# EAGLE design register (EAGLE 5.11)
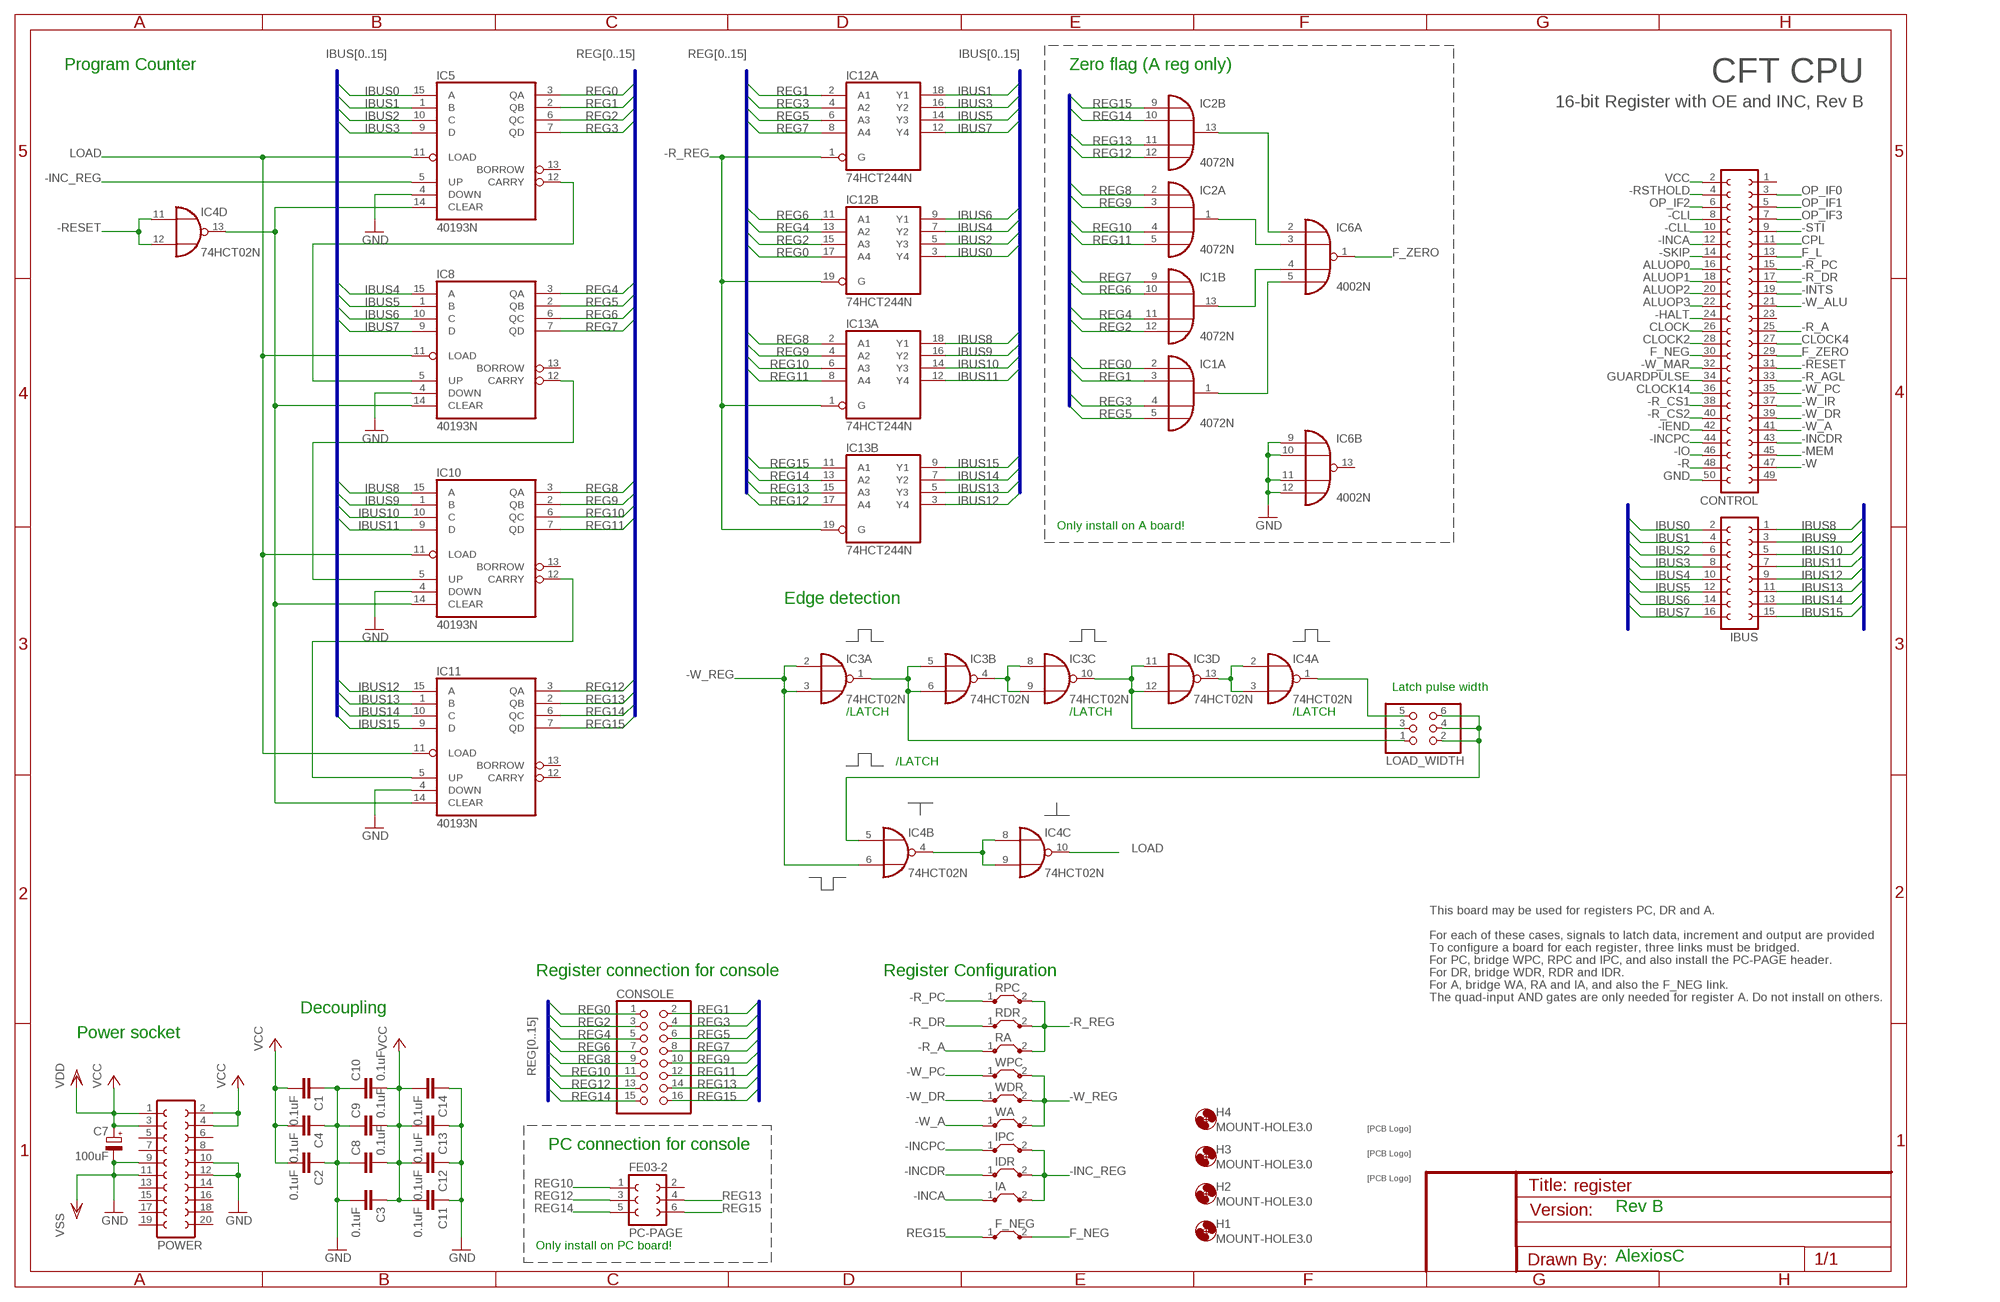
[diagram p0: schematic, sheet 1]

## Parts
C1  0.1uF  C-EU025-025X050  [C025-025X050]
C2  0.1uF  C-EU025-025X050  [C025-025X050]
C3  0.1uF  C-EU025-025X050  [C025-025X050]
C4  0.1uF  C-EU025-025X050  [C025-025X050]
C7  100uF  CPOL-EUE2.5-6  [E2,5-6]
C8  0.1uF  C-EU025-025X050  [C025-025X050]
C9  0.1uF  C-EU025-025X050  [C025-025X050]
C10  0.1uF  C-EU025-025X050  [C025-025X050]
C11  0.1uF  C-EU025-025X050  [C025-025X050]
C12  0.1uF  C-EU025-025X050  [C025-025X050]
C13  0.1uF  C-EU025-025X050  [C025-025X050]
C14  0.1uF  C-EU025-025X050  [C025-025X050]
CONSOLE  PINHD-2X8/90  [2X08/90]
CONTROL  FE25-2  [FE25-2]
F_NEG  J5MM  [05]
H1  MOUNT-HOLE3.0  [3,0]
H2  MOUNT-HOLE3.0  [3,0]
H3  MOUNT-HOLE3.0  [3,0]
H4  MOUNT-HOLE3.0  [3,0]
IA  J5MM  [05]
IBUS  FE08-2  [FE08-2]
IC1  4072N  [DIL14]
IC2  4072N  [DIL14]
IC3  74HCT02N  [DIL14]
IC4  74HCT02N  [DIL14]
IC5  40193N  [DIL16]
IC6  4002N  [DIL14]
IC8  40193N  [DIL16]
IC10  40193N  [DIL16]
IC11  40193N  [DIL16]
IC12  74HCT244N  [DIL20]
IC13  74HCT244N  [DIL20]
IDR  J5MM  [05]
IPC  J5MM  [05]
LOAD_WIDTH  PINHD-2X3/90  [2X03/90]
PC-PAGE  FE03-2  [FE03-2]
POWER  FE10-2  [FE10-2]
RA  J5MM  [05]
RDR  J5MM  [05]
RPC  J5MM  [05]
U$1  SIGNATUREPLANE  [SIGNATURE_PLANE]
U$2  SIGNATUREPLANE  [SIGNATURE_PLANE]
U$3  SIGNATURESILK  [SIGNATURE]
WA  J5MM  [05]
WDR  J5MM  [05]
WPC  J5MM  [05]

## Nets
-CLI: CONTROL.8
-CLL: CONTROL.10
-HALT: CONTROL.24
-IEND: CONTROL.42
-INC_REG: IA.2 IC5.5(UP) IDR.2 IPC.2
-INCA: CONTROL.12 IA.1
-INCDR: CONTROL.43 IDR.1
-INCPC: CONTROL.44 IPC.1
-INTS: CONTROL.19
-IO: CONTROL.46
-MEM: CONTROL.45
-R: CONTROL.48
-R_A: CONTROL.25 RA.1
-R_AGL: CONTROL.33
-R_CS1: CONTROL.38
-R_CS2: CONTROL.40
-R_DR: CONTROL.17 RDR.1
-R_PC: CONTROL.15 RPC.1
-R_REG: IC12.1(A:G) IC12.19(B:G) IC13.1(A:G) IC13.19(B:G) RA.2 RDR.2 RPC.2
-RESET: CONTROL.31 IC4.11(D:I0) IC4.12(D:I1)
-RSTHOLD: CONTROL.4
-SKIP: CONTROL.14
-STI: CONTROL.9
-W: CONTROL.47
-W_A: CONTROL.41 WA.1
-W_ALU: CONTROL.21
-W_DR: CONTROL.39 WDR.1
-W_IR: CONTROL.37
-W_MAR: CONTROL.32
-W_PC: CONTROL.35 WPC.1
-W_REG: IC3.2(A:I0) IC3.3(A:I1) IC4.6(B:I1) WA.2 WDR.2 WPC.2
ALUOP0: CONTROL.16
ALUOP1: CONTROL.18
ALUOP2: CONTROL.20
ALUOP3: CONTROL.22
CLOCK: CONTROL.26
CLOCK2: CONTROL.28
CLOCK4: CONTROL.27
CLOCK14: CONTROL.36
CPL: CONTROL.11
F_L: CONTROL.13
F_NEG: CONTROL.30
F_ZERO: CONTROL.29 IC6.1(A:O)
GND: C1.1 C2.1 C3.2 C4.1 C7.- C8.1 C9.1 C10.1 C11.1 C12.1 C13.1 C14.1 CONTROL.50 IC5.4(DOWN) IC6.9(B:I0) IC6.10(B:I1) IC6.11(B:I2) IC6.12(B:I3) IC8.4(DOWN) IC10.4(DOWN) IC11.4(DOWN) POWER.9 POWER.10 POWER.11 POWER.12 ; supply symbol labelled VSS
GUARDPULSE: CONTROL.34
IBUS0: IBUS.2 IC5.15(A) IC12.3(B:Y4)
IBUS1: IBUS.4 IC5.1(B) IC12.18(A:Y1)
IBUS2: IBUS.6 IC5.10(C) IC12.5(B:Y3)
IBUS3: IBUS.8 IC5.9(D) IC12.16(A:Y2)
IBUS4: IBUS.10 IC8.15(A) IC12.7(B:Y2)
IBUS5: IBUS.12 IC8.1(B) IC12.14(A:Y3)
IBUS6: IBUS.14 IC8.10(C) IC12.9(B:Y1)
IBUS7: IBUS.16 IC8.9(D) IC12.12(A:Y4)
IBUS8: IBUS.1 IC10.15(A) IC13.18(A:Y1)
IBUS9: IBUS.3 IC10.1(B) IC13.16(A:Y2)
IBUS10: IBUS.5 IC10.10(C) IC13.14(A:Y3)
IBUS11: IBUS.7 IC10.9(D) IC13.12(A:Y4)
IBUS12: IBUS.9 IC11.15(A) IC13.3(B:Y4)
IBUS13: IBUS.11 IC11.1(B) IC13.5(B:Y3)
IBUS14: IBUS.13 IC11.10(C) IC13.7(B:Y2)
IBUS15: IBUS.15 IC11.9(D) IC13.9(B:Y1)
LOAD: IC4.10(C:O) IC5.11(LOAD) IC8.11(LOAD) IC10.11(LOAD) IC11.11(LOAD)
N$1: IC2.13(B:O) IC6.2(A:I0)
N$2: IC2.1(A:O) IC6.3(A:I1)
N$3: IC1.13(B:O) IC6.4(A:I2)
N$4: IC1.1(A:O) IC6.5(A:I3)
N$17: IC3.1(A:O) IC3.5(B:I0) IC3.6(B:I1) LOAD_WIDTH.1
N$18: IC3.4(B:O) IC3.8(C:I0) IC3.9(C:I1)
N$19: IC3.10(C:O) IC3.11(D:I0) IC3.12(D:I1) LOAD_WIDTH.3
N$20: IC3.13(D:O) IC4.2(A:I0) IC4.3(A:I1)
N$21: IC4.1(A:O) LOAD_WIDTH.5
N$22: IC4.5(B:I0) LOAD_WIDTH.2 LOAD_WIDTH.4 LOAD_WIDTH.6
N$23: IC4.4(B:O) IC4.8(C:I0) IC4.9(C:I1)
N$25: IC5.12(CARRY) IC8.5(UP)
N$26: IC4.13(D:O) IC5.14(CLEAR) IC8.14(CLEAR) IC10.14(CLEAR) IC11.14(CLEAR)
N$29: IC8.12(CARRY) IC10.5(UP)
N$31: IC10.12(CARRY) IC11.5(UP)
OP_IF0: CONTROL.3
OP_IF1: CONTROL.5
OP_IF2: CONTROL.6
OP_IF3: CONTROL.7
REG0: CONSOLE.1 IC1.2(A:I0) IC5.3(QA) IC12.17(B:A4)
REG1: CONSOLE.2 IC1.3(A:I1) IC5.2(QB) IC12.2(A:A1)
REG2: CONSOLE.3 IC1.12(B:I3) IC5.6(QC) IC12.15(B:A3)
REG3: CONSOLE.4 IC1.4(A:I2) IC5.7(QD) IC12.4(A:A2)
REG4: CONSOLE.5 IC1.11(B:I2) IC8.3(QA) IC12.13(B:A2)
REG5: CONSOLE.6 IC1.5(A:I3) IC8.2(QB) IC12.6(A:A3)
REG6: CONSOLE.7 IC1.10(B:I1) IC8.6(QC) IC12.11(B:A1)
REG7: CONSOLE.8 IC1.9(B:I0) IC8.7(QD) IC12.8(A:A4)
REG8: CONSOLE.9 IC2.2(A:I0) IC10.3(QA) IC13.2(A:A1)
REG9: CONSOLE.10 IC2.3(A:I1) IC10.2(QB) IC13.4(A:A2)
REG10: CONSOLE.11 IC2.4(A:I2) IC10.6(QC) IC13.6(A:A3) PC-PAGE.1
REG11: CONSOLE.12 IC2.5(A:I3) IC10.7(QD) IC13.8(A:A4)
REG12: CONSOLE.13 IC2.12(B:I3) IC11.3(QA) IC13.17(B:A4) PC-PAGE.3
REG13: CONSOLE.14 IC2.11(B:I2) IC11.2(QB) IC13.15(B:A3) PC-PAGE.4
REG14: CONSOLE.15 IC2.10(B:I1) IC11.6(QC) IC13.13(B:A2) PC-PAGE.5
REG15: CONSOLE.16 F_NEG.1 IC2.9(B:I0) IC11.7(QD) IC13.11(B:A1) PC-PAGE.6
VCC: C1.2 C2.2 C3.1 C4.2 C7.+ C8.2 C9.2 C10.2 C11.2 C12.2 C13.2 C14.2 CONTROL.2 POWER.1 POWER.2 POWER.3 POWER.4 ; supply symbol labelled VDD
Unconnected: CONTROL.1 CONTROL.23 CONTROL.49 F_NEG.2 IC5.13(BORROW) IC6.13(B:O) IC8.13(BORROW) IC10.13(BORROW) IC11.12(CARRY) IC11.13(BORROW) PC-PAGE.2 POWER.5 POWER.6 POWER.7 POWER.8 POWER.13 POWER.14 POWER.15 POWER.16 POWER.17 POWER.18 POWER.19 POWER.20

## Buses
IBUS[0..15]
REG[0..15]

## Notes on the sheet
- Program Counter | Zero flag (A reg only)
- CFT CPU
- 16-bit Register with OE and INC, Rev B
- Only install on A board!
- Edge detection
- Latch pulse width
- /LATCH | /LATCH | /LATCH
- /LATCH
- This board may be used for registers PC, DR and A.
- For each of these cases, signals to latch data, increment and output are provided
- To configure a board for each register, three links must be bridged.
- For PC, bridge WPC, RPC and IPC, and also install the PC-PAGE header.
- Register connection for console | Register Configuration | For DR, bridge WDR, RDR and IDR.
- For A, bridge WA, RA and IA, and also the F_NEG link.
- The quad-input AND gates are only needed for register A. Do not install on others.
- Decoupling
- Power socket
- PC connection for console
- Rev B
- Only install on PC board!
- AlexiosC

## Power pins joined to a net without a drawn wire
GND: IC1.7(P:VSS) IC2.7(P:VSS) IC3.7(P:GND) IC4.7(P:GND) IC5.8(VSS) IC6.7(P:VSS) IC8.8(VSS) IC10.8(VSS) IC11.8(VSS) IC12.10(P:GND) IC13.10(P:GND)
VCC: IC1.14(P:VDD) IC2.14(P:VDD) IC3.14(P:VCC) IC4.14(P:VCC) IC5.16(VDD) IC6.14(P:VDD) IC8.16(VDD) IC10.16(VDD) IC11.16(VDD) IC12.20(P:VCC) IC13.20(P:VCC)

## Library data of the parts
C1-C4 C8-C14 = rcl:C-EU: CAPACITOR, European symbol
C7 = rcl:CPOL-EU: POLARIZED CAPACITOR, European symbol
CONSOLE = pinhead:PINHD-2X8: PIN HEADER
CONTROL = con-lsta:FE25-2: FEMALE HEADER
F_NEG IA IDR IPC RA RDR RPC WA WDR WPC = jumper:J: Bridge
H1-H4 = holes:MOUNT-HOLE: MOUNTING HOLE with drill center marker
IBUS = con-lsta:FE08-2: FEMALE HEADER
IC1 IC2 = 40xx:4072: Dual 4-input OR
IC3 IC4 = 74xx-eu:74*02: Quad 2-input NOR gate
IC5 IC8 IC10 IC11 = 40xx:40193: Binary up down COUNTER
IC6 = 40xx:4002: 4-input NOR
IC12 IC13 = 74xx-eu:74*244: Octal BUFFER and LINE DRIVER, 3-state
LOAD_WIDTH = pinhead:PINHD-2X3: PIN HEADER
PC-PAGE = alexios:FE03-2: A 2x3 female header.
POWER = con-lsta:FE10-2: FEMALE HEADER; OC_FARNELL: unknown; OC_NEWARK: unknown
U$1-U$3 = alexios:SIGNATURE: Soup signature

## Net classes
1 Decoupling: width 1.27 mm

## Board
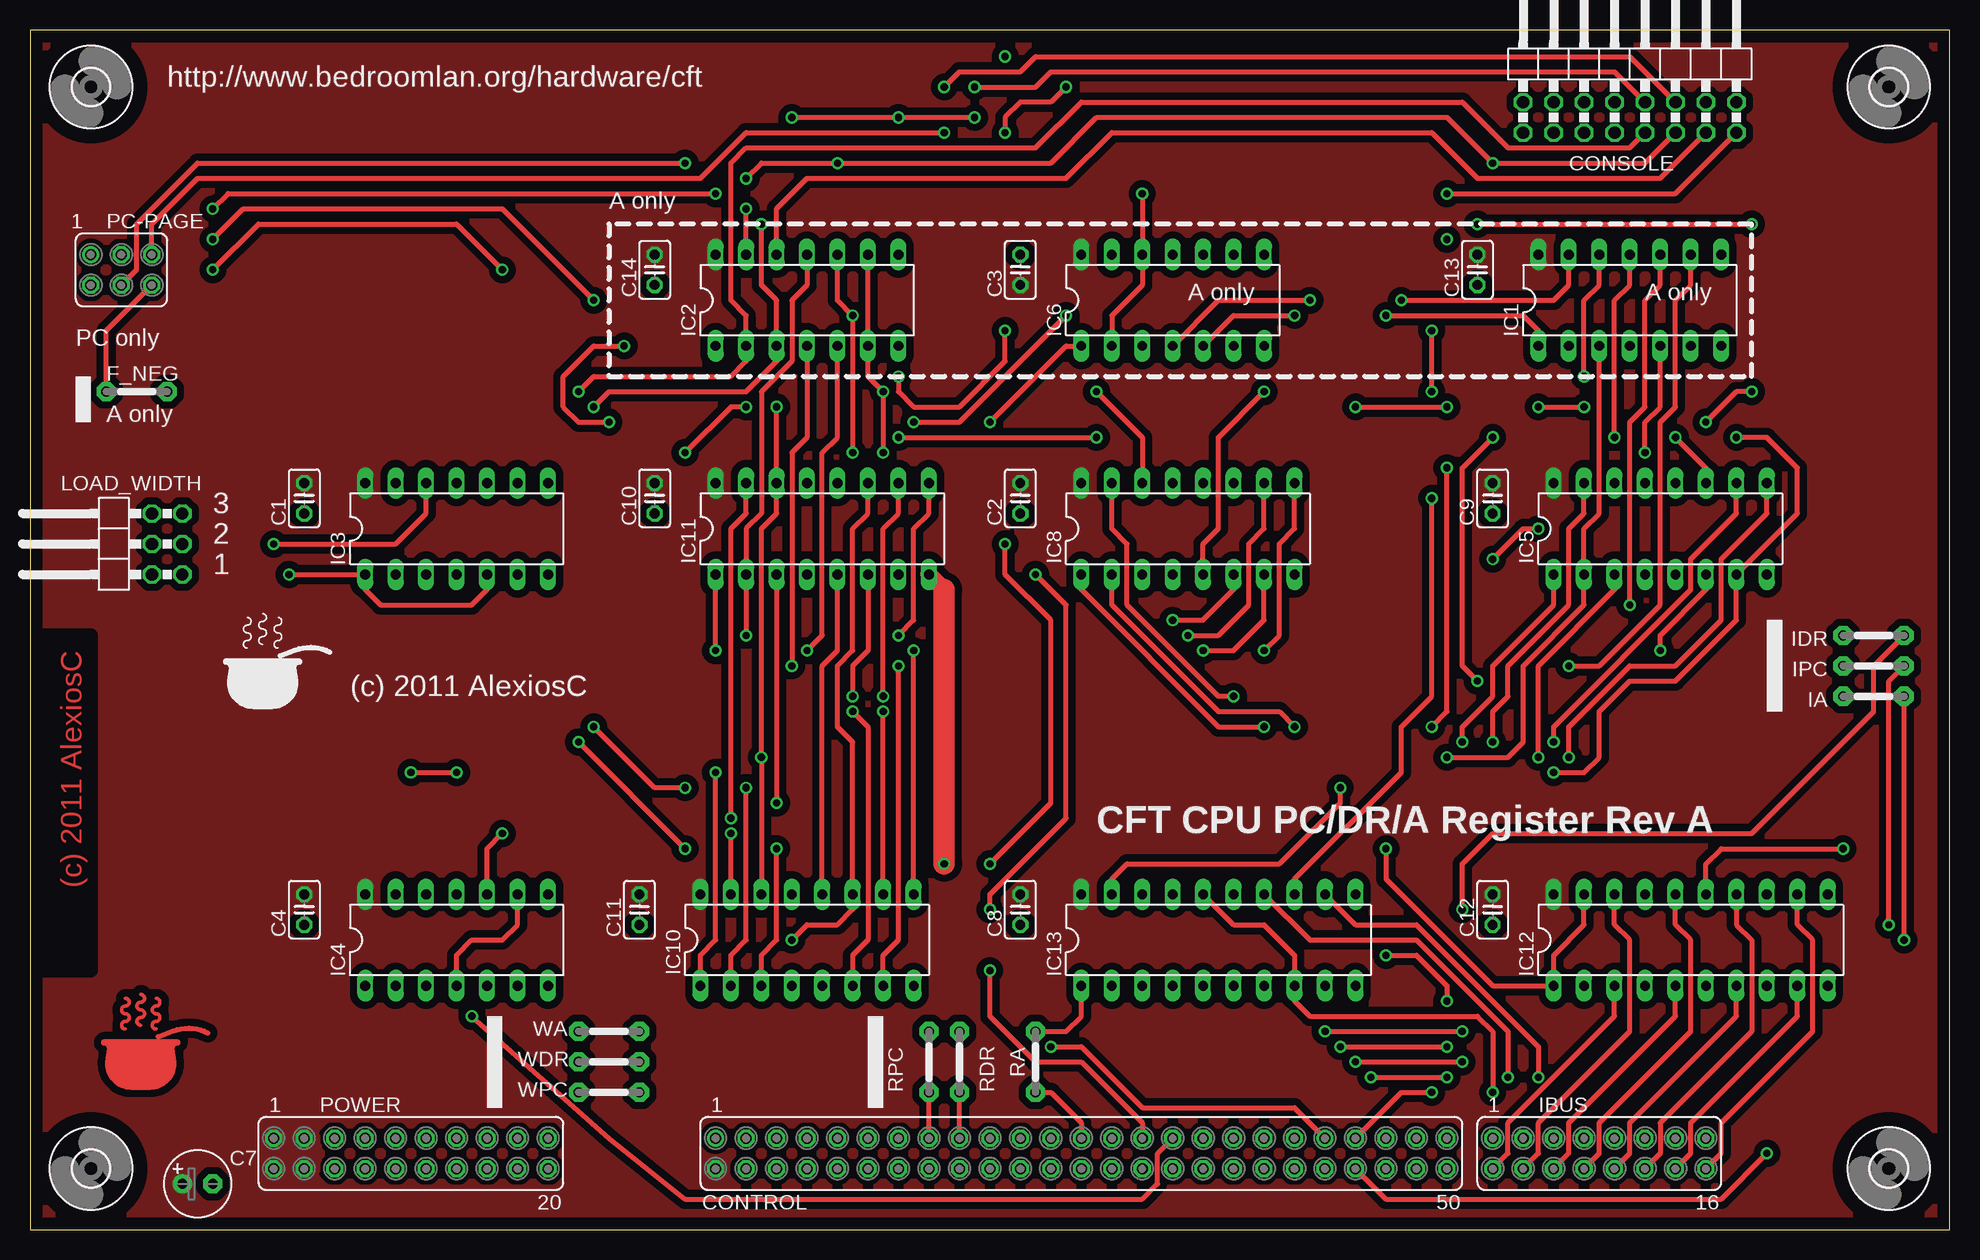
[diagram p1: board, top side]
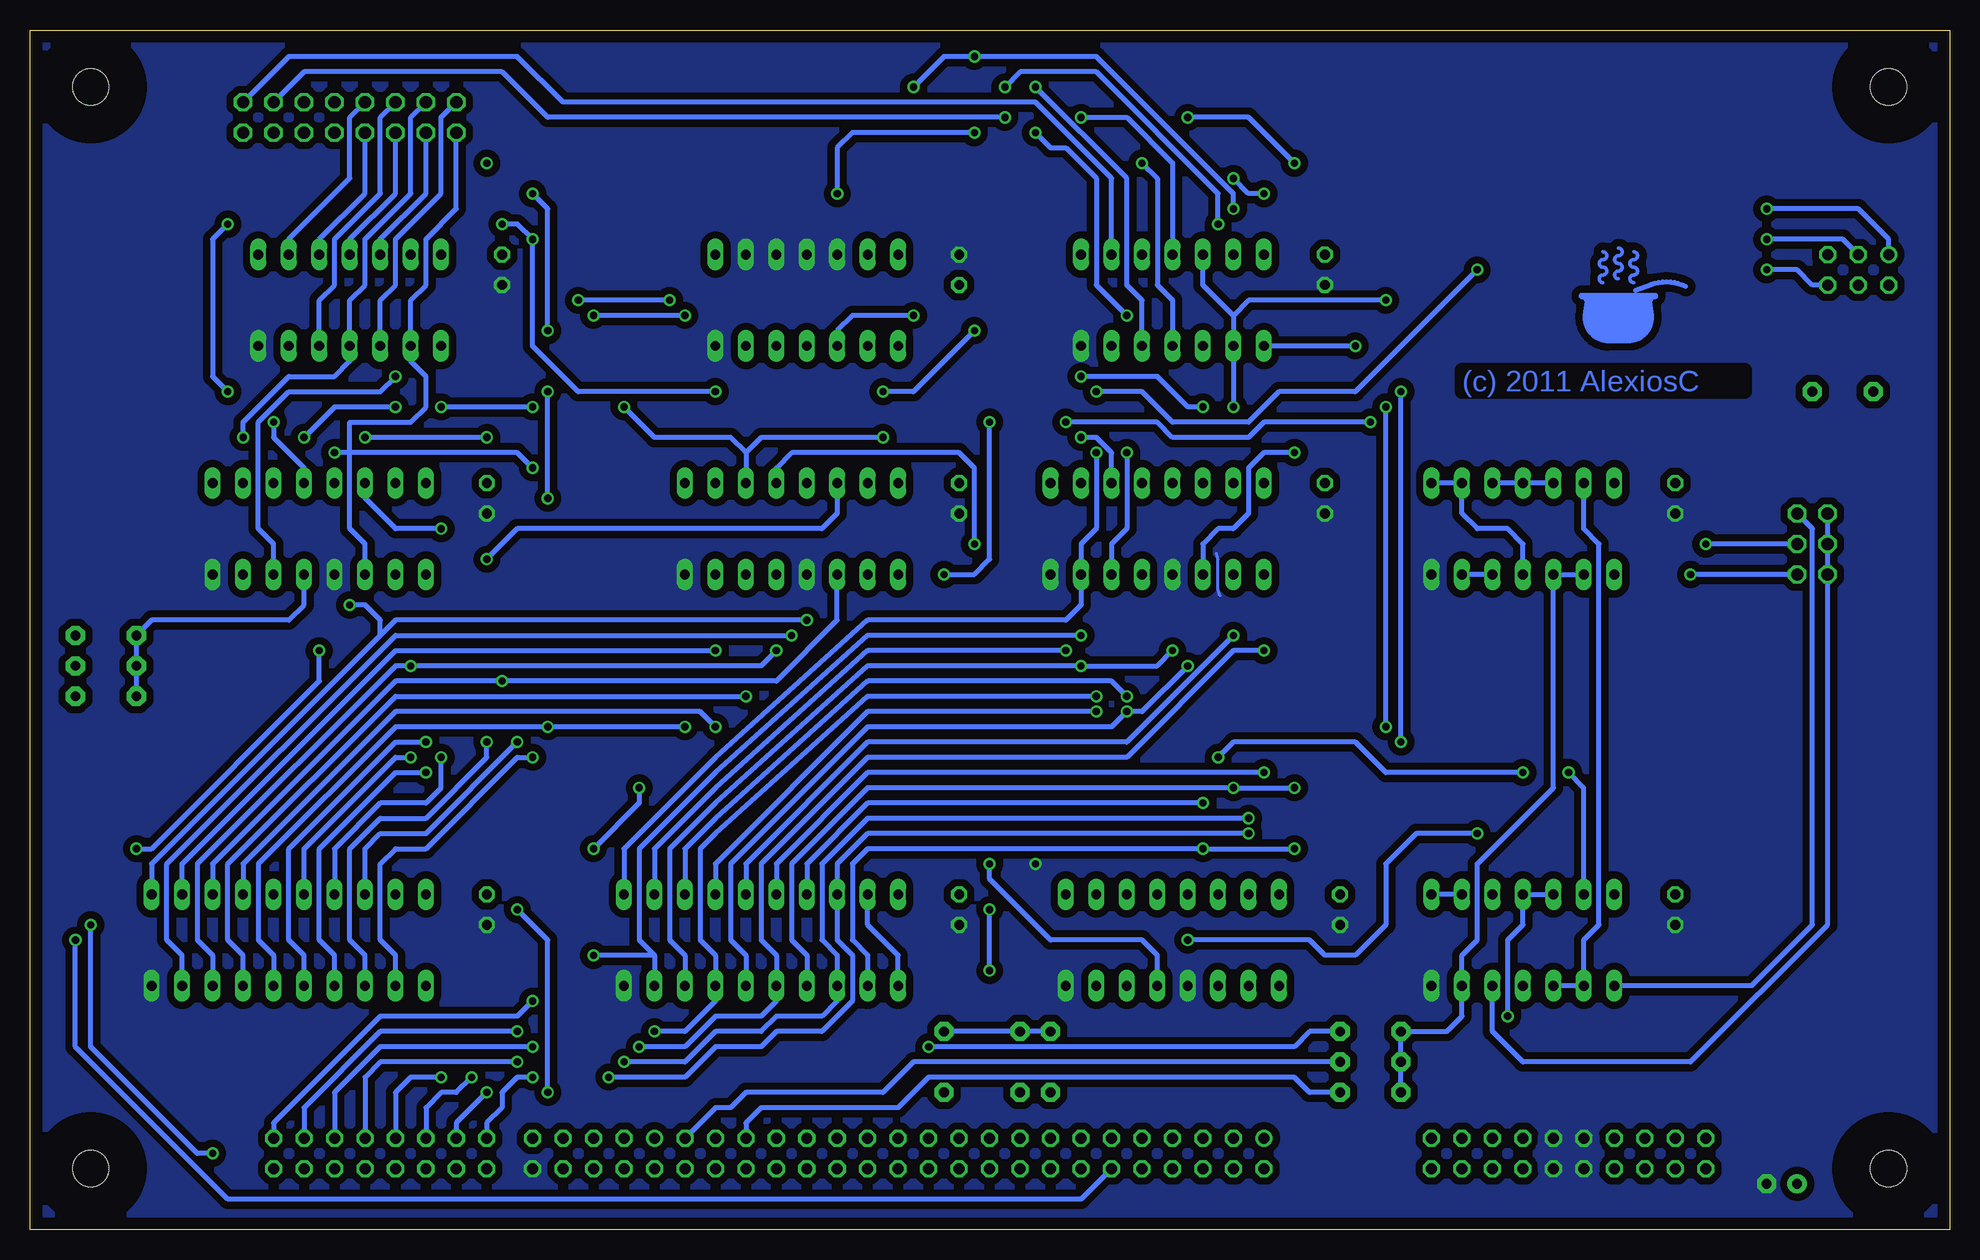
[diagram p2: board, bottom side, seen from below]

Size 160 x 100 mm. Coordinates in mm from the lower left corner, seen from the top.
Outline: 0,0 160,0 160,100 0,100 0,0
Copper layers (1*16): Top 0.035mm / dielectric 1.5mm / Bottom 0.035mm
Design rules "olimex-10mil": minimum track width 10mil, minimum drill 24mil, track to track 10mil, track to pad 10mil, pad to pad 10mil, via to via 10mil, smd to smd 10mil, copper to edge 40mil, drill to drill 10mil, minimum pad ring 10mil, minimum via ring 8mil, stop-mask expansion 0mil, vias tented up to drill 0mil, thermal gap 10mil
tRestrict: area 1.3,21.6 to 5.1,49.5

### Footprints (pad centres in the part's own frame; a part is rotated, then mirrored left to right if it is on the bottom)
C025-025X050 = drill 0.813 octagon: 1 -1.27,0; 2 1.27,0
E2,5-6 = drill 0.813 pad 1.6 round: + -1.27,0 | drill 0.813 pad 1.6 octagon: - 1.27,0
2X08/90 = drill 1.016 octagon: 1 -8.89,-6.35; 2 -8.89,-3.81; 3 -6.35,-6.35; 4 -6.35,-3.81; 5 -3.81,-6.35; 6 -3.81,-3.81; 7 -1.27,-6.35; 8 -1.27,-3.81; 9 1.27,-6.35; 10 1.27,-3.81; 11 3.81,-6.35; 12 3.81,-3.81; 13 6.35,-6.35; 14 6.35,-3.81; 15 8.89,-6.35; 16 8.89,-3.81
FE25-2 = drill 0.914 round: 1 -30.48,1.27; 41 20.32,1.27 | drill 0.914 octagon: 2 -30.48,-1.27; 3 -27.94,1.27; 4 -27.94,-1.27; 5 -25.4,1.27; 6 -25.4,-1.27; 7 -22.86,1.27; 8 -22.86,-1.27; 9 -20.32,1.27; 10 -20.32,-1.27; 11 -17.78,1.27; 12 -17.78,-1.27; 13 -15.24,1.27; 14 -15.24,-1.27; 15 -12.7,1.27; 16 -12.7,-1.27; 17 -10.16,1.27; 18 -10.16,-1.27; 19 -7.62,1.27; 20 -7.62,-1.27; 21 -5.08,1.27; 22 -5.08,-1.27; 23 -2.54,1.27; 24 -2.54,-1.27; 25 0,1.27; 26 0,-1.27; 27 2.54,1.27; 28 2.54,-1.27; 29 5.08,1.27; 30 5.08,-1.27; 31 7.62,1.27; 32 7.62,-1.27; 33 10.16,1.27; 34 10.16,-1.27; 35 12.7,1.27; 36 12.7,-1.27; 37 15.24,1.27; 38 15.24,-1.27; 39 17.78,1.27; 40 17.78,-1.27; 42 20.32,-1.27; 43 22.86,1.27; 44 22.86,-1.27; 45 25.4,1.27; 46 25.4,-1.27; 47 27.94,1.27; 48 27.94,-1.27; 49 30.48,1.27; 50 30.48,-1.27
05 = drill 0.813 pad 1.6 octagon: 1 -2.54,0; 2 2.54,0
3,0 = hole 3: 0,0
FE08-2 = drill 0.914 octagon: 1 -8.89,1.27; 2 -8.89,-1.27; 3 -6.35,1.27; 4 -6.35,-1.27; 5 -3.81,1.27; 6 -3.81,-1.27; 7 -1.27,1.27; 8 -1.27,-1.27; 9 1.27,1.27; 10 1.27,-1.27; 11 3.81,1.27; 12 3.81,-1.27; 13 6.35,1.27; 14 6.35,-1.27; 15 8.89,1.27; 16 8.89,-1.27
DIL14 = drill 0.813 long: 1 -7.62,-3.81; 2 -5.08,-3.81; 3 -2.54,-3.81; 4 0,-3.81; 5 2.54,-3.81; 6 5.08,-3.81; 7 7.62,-3.81; 8 7.62,3.81; 9 5.08,3.81; 10 2.54,3.81; 11 0,3.81; 12 -2.54,3.81; 13 -5.08,3.81; 14 -7.62,3.81
DIL16 = drill 0.813 long: 1 -8.89,-3.81; 2 -6.35,-3.81; 3 -3.81,-3.81; 4 -1.27,-3.81; 5 1.27,-3.81; 6 3.81,-3.81; 7 6.35,-3.81; 8 8.89,-3.81; 9 8.89,3.81; 10 6.35,3.81; 11 3.81,3.81; 12 1.27,3.81; 13 -1.27,3.81; 14 -3.81,3.81; 15 -6.35,3.81; 16 -8.89,3.81
DIL20 = drill 0.813 long: 1 -11.43,-3.81; 2 -8.89,-3.81; 3 -6.35,-3.81; 4 -3.81,-3.81; 5 -1.27,-3.81; 6 1.27,-3.81; 7 3.81,-3.81; 8 6.35,-3.81; 9 8.89,-3.81; 10 11.43,-3.81; 11 11.43,3.81; 12 8.89,3.81; 13 6.35,3.81; 14 3.81,3.81; 15 1.27,3.81; 16 -1.27,3.81; 17 -3.81,3.81; 18 -6.35,3.81; 19 -8.89,3.81; 20 -11.43,3.81
2X03/90 = drill 1.016 octagon: 1 -2.54,-6.35; 2 -2.54,-3.81; 3 0,-6.35; 4 0,-3.81; 5 2.54,-6.35; 6 2.54,-3.81
FE03-2 = drill 0.914 round: 1 -2.54,1.27 | drill 0.914 octagon: 2 -2.54,-1.27; 3 0,1.27; 4 0,-1.27; 5 2.54,1.27; 6 2.54,-1.27
FE10-2 = drill 0.914 octagon: 1 -11.43,1.27; 2 -11.43,-1.27; 3 -8.89,1.27; 4 -8.89,-1.27; 5 -6.35,1.27; 6 -6.35,-1.27; 7 -3.81,1.27; 8 -3.81,-1.27; 9 -1.27,1.27; 10 -1.27,-1.27; 11 1.27,1.27; 12 1.27,-1.27; 13 3.81,1.27; 14 3.81,-1.27; 15 6.35,1.27; 16 6.35,-1.27; 17 8.89,1.27; 18 8.89,-1.27; 19 11.43,1.27; 20 11.43,-1.27

### Placement (x,y rotation side)
C1  22.86,60.96 90 top
C2  82.55,60.96 90 top
C3  82.55,80.01 90 top
C4  22.86,26.67 90 top
C7  13.97,3.81 0 top
C8  82.55,26.67 90 top
C9  121.92,60.96 90 top
C10  52.07,60.96 90 top
C11  50.8,26.67 90 top
C12  121.92,26.67 90 top
C13  120.65,80.01 90 top
C14  52.07,80.01 90 top
CONSOLE  133.35,97.79 0 top
CONTROL  87.63,6.35 0 top
F_NEG  8.89,69.85 0 top
H1  154.94,95.25 0 top
H2  154.94,5.08 0 top
H3  5.08,5.08 0 top
H4  5.08,95.25 0 top
IA  153.67,44.45 180 top
IBUS  130.81,6.35 0 top
IC1  133.35,77.47 0 top
IC2  64.77,77.47 0 top
IC3  35.56,58.42 0 top
IC4  35.56,24.13 0 top
IC5  135.89,58.42 0 top
IC6  95.25,77.47 0 top
IC8  96.52,58.42 0 top
IC10  64.77,24.13 0 top
IC11  66.04,58.42 0 top
IC12  138.43,24.13 0 top
IC13  99.06,24.13 0 top
IDR  153.67,49.53 180 top
IPC  153.67,46.99 180 top
LOAD_WIDTH  6.35,57.15 90 top
PC-PAGE  7.62,80.01 0 top
POWER  31.75,6.35 0 top
RA  83.82,13.97 90 top
RDR  77.47,13.97 90 top
RPC  74.93,13.97 90 top
U$1  6.35,11.43 0 top
U$2  30.48,73.66 0 bottom
U$3  16.51,43.18 0 top
WA  48.26,16.51 180 top
WDR  48.26,13.97 180 top
WPC  48.26,11.43 180 top

### Tracks (layer width: path | path; a pad name or v marks a point on that pad's centre or on a via)
-INC_REG
  Bottom 0.406: IC5.5 137.16,52.07 138.43,50.8 149.86,50.8 IDR.2 IPC.2 IA.2
-INCA  (via drill 0.6)
  Top 0.406: v156.21,24.13 IA.1
  Bottom 0.406: v156.21,24.13 156.21,15.24 143.51,2.54 72.39,2.54 CONTROL.12
-INCDR  (via drill 0.6)
  Top 0.406: IDR.1 153.67,46.99 153.67,43.18 143.51,33.02 121.92,33.02 119.38,30.48 v119.38,26.67 | CONTROL.43 114.3,11.43 v116.84,11.43
  Bottom 0.406: v119.38,26.67 116.84,24.13 v116.84,11.43
-INCPC  (via drill 0.6)
  Top 0.406: IPC.1 154.94,45.72 v154.94,25.4 | CONTROL.44 113.03,2.54 140.97,2.54 v144.78,6.35
  Bottom 0.406: v154.94,25.4 154.94,15.24 146.05,6.35 v144.78,6.35
-R_A
  Top 0.406: CONTROL.25 87.63,8.89 85.09,11.43 RA.1
-R_DR
  Top 0.406: CONTROL.17 RDR.1
-R_PC
  Top 0.406: CONTROL.15 RPC.1
-R_REG  (via drill 0.6)
  Top 0.406: IC12.19 129.54,25.4 127,22.86 IC12.1 121.92,20.32 113.03,29.21 v113.03,31.75 | v109.22,36.83 109.22,35.56 104.14,30.48 91.44,30.48 90.17,29.21 IC13.19 | RA.2 86.36,16.51 87.63,17.78 IC13.1
  Bottom 0.406: IC13.19 90.17,25.4 87.63,22.86 IC13.1 | RPC.2 RDR.2 RA.2 | v109.22,36.83 109.22,35.56 v113.03,31.75
-RESET  (via drill 0.61)
  Top 0.406: CONTROL.31 93.98,6.35 93.98,3.81 92.71,2.54 54.61,2.54 48.26,7.62 v36.83,17.78
  Bottom 0.406: IC4.12 IC4.11 35.56,25.4 36.83,24.13 v36.83,17.78
-W_A  (via drill 0.6)
  Top 0.406: v85.09,15.24 87.63,15.24 92.71,10.16 105.41,10.16 CONTROL.41
  Bottom 0.406: v85.09,15.24 54.61,15.24 53.34,16.51 WA.1
-W_DR
  Bottom 0.406: CONTROL.39 102.87,10.16 101.6,10.16 100.33,11.43 88.9,11.43 86.36,13.97 WDR.1
-W_PC
  Bottom 0.406: CONTROL.35 100.33,8.89 99.06,10.16 87.63,10.16 85.09,12.7 54.61,12.7 53.34,11.43 WPC.1
-W_REG
  Bottom 0.406: WPC.2 WDR.2 WA.2 41.91,16.51 40.64,17.78 IC4.6 40.64,22.86 39.37,24.13 39.37,30.48 33.02,36.83 IC3.3 IC3.2
F_ZERO  (via drill 0.6)
  Top 0.406: IC6.1 86.36,73.66 v80.01,67.31 | v80.01,21.59 80.01,17.78 83.82,13.97 87.63,13.97 92.71,8.89 CONTROL.29 | v80.01,26.67 80.01,27.94 86.36,34.29 86.36,52.07 v83.82,54.61
  Bottom 0.406: v83.82,54.61 81.28,54.61 80.01,55.88 v80.01,67.31 | v80.01,21.59 v80.01,26.67
GND  (via drill 0.6)
  Top 1.422: 76.2,53.34 IC11.8
  Top 1.778: v76.2,30.48 76.2,53.34
  Bottom 0.254: 60.81,52.84 60.96,53.34 60.96,55.88 61.11,56.38
  pour Bottom (isolate 0.508, no thermals): 30.48,8.89 29.21,7.62 29.21,5.08 30.48,3.81 33.02,3.81 34.29,5.08 34.29,7.62 33.02,8.89
  pour Bottom (isolate 0.61, no thermals): 0,100.33 0,0 160.02,0 160.02,100.33
IBUS0  (via drill 0.6)
  Top 0.406: IC5.15 129.54,59.69 128.27,58.42 128.27,52.07 123.19,46.99 123.19,44.45 121.92,43.18 v121.92,40.64 | IBUS.2 123.19,6.35 123.19,8.89 132.08,17.78 IC12.3
  Bottom 0.406: IC12.3 132.08,22.86 133.35,24.13 133.35,31.75 130.81,34.29 127,34.29 121.92,39.37 v121.92,40.64
IBUS1  (via drill 0.6)
  Top 0.406: v119.38,40.64 119.38,41.91 121.92,44.45 121.92,46.99 127,52.07 IC5.1 | IBUS.4 125.73,6.35 125.73,8.89 133.35,16.51 133.35,24.13 132.08,25.4 IC12.18
  Bottom 0.406: IC12.18 132.08,31.75 130.81,33.02 127,33.02 v119.38,40.64
IBUS2  (via drill 0.6)
  Top 0.406: IC5.10 142.24,59.69 138.43,55.88 138.43,53.34 127,41.91 v127,40.64 | IBUS.6 128.27,6.35 128.27,8.89 137.16,17.78 IC12.5
  Bottom 0.406: IC12.5 137.16,22.86 138.43,24.13 138.43,31.75 129.54,40.64 v127,40.64
IBUS3  (via drill 0.6)
  Top 0.406: IC5.9 144.78,59.69 140.97,55.88 140.97,50.8 137.16,46.99 133.35,46.99 128.27,41.91 v128.27,39.37 | IBUS.8 130.81,6.35 130.81,8.89 138.43,16.51 138.43,24.13 137.16,25.4 IC12.16
  Bottom 0.406: IC12.16 137.16,31.75 129.54,39.37 v128.27,39.37
IBUS4  (via drill 0.6)
  Top 0.406: v100.33,44.45 99.06,44.45 91.44,52.07 91.44,57.15 90.17,58.42 IC8.15 | IBUS.10 133.35,6.35 133.35,8.89 142.24,17.78 IC12.7
  Bottom 0.406: IC12.7 142.24,22.86 143.51,24.13 143.51,30.48 129.54,44.45 v100.33,44.45
IBUS5  (via drill 0.6)
  Top 0.406: v102.87,41.91 99.06,41.91 87.63,53.34 IC8.1 | IBUS.12 135.89,6.35 135.89,8.89 143.51,16.51 143.51,24.13 142.24,25.4 IC12.14
  Bottom 0.406: IC12.14 142.24,30.48 129.54,43.18 104.14,43.18 v102.87,41.91
IBUS6  (via drill 0.6)
  Top 0.406: v96.52,49.53 99.06,49.53 101.6,52.07 101.6,57.15 102.87,58.42 IC8.10 | IBUS.14 138.43,6.35 138.43,8.89 147.32,17.78 IC12.9
  Bottom 0.406: IC12.9 147.32,22.86 148.59,24.13 148.59,30.48 129.54,49.53 v96.52,49.53
IBUS7  (via drill 0.6)
  Top 0.406: v102.87,48.26 104.14,49.53 104.14,57.15 105.41,58.42 IC8.9 | IBUS.16 140.97,6.35 140.97,8.89 148.59,16.51 148.59,24.13 147.32,25.4 IC12.12
  Bottom 0.406: IC12.12 147.32,30.48 129.54,48.26 v102.87,48.26
IBUS8  (via drill 0.6)
  Top 0.406: IC10.15 v58.42,33.02 | v111.76,12.7 v118.11,12.7
  Bottom 0.406: v58.42,33.02 90.17,33.02 92.71,30.48 IC13.18 92.71,24.13 91.44,22.86 91.44,19.05 93.98,16.51 97.79,16.51 99.06,15.24 102.87,15.24 105.41,12.7 v111.76,12.7 | IBUS.1 121.92,8.89 120.65,10.16 120.65,11.43 119.38,12.7 v118.11,12.7
IBUS9  (via drill 0.6)
  Top 0.406: IC10.1 55.88,22.86 57.15,24.13 v57.15,38.1 | IC13.16 100.33,25.4 102.87,25.4 105.41,22.86 105.41,19.05 106.68,17.78 120.65,17.78 121.92,16.51 v121.92,11.43
  Bottom 0.406: IC13.16 97.79,30.48 90.17,38.1 v57.15,38.1 | IBUS.3 124.46,8.89 v121.92,11.43
IBUS10  (via drill 0.6)
  Top 0.406: IC10.10 v71.12,43.18 | v123.19,12.7 123.19,16.51 115.57,24.13 106.68,24.13 IC13.14
  Bottom 0.406: IC13.14 102.87,30.48 90.17,43.18 v71.12,43.18 | IBUS.5 127,10.16 125.73,11.43 124.46,11.43 v123.19,12.7
IBUS11  (via drill 0.6)
  Top 0.406: IC10.9 v73.66,48.26 | v125.73,12.7 125.73,15.24 115.57,25.4 110.49,25.4 IC13.12
  Bottom 0.406: IC13.12 107.95,31.75 102.87,36.83 90.17,48.26 v73.66,48.26 | IBUS.7 129.54,11.43 128.27,12.7 v125.73,12.7
IBUS12  (via drill 0.6)
  Top 0.406: IC11.15 59.69,59.69 58.42,58.42 v58.42,34.29 | v110.49,13.97 v119.38,13.97
  Bottom 0.406: v58.42,34.29 90.17,34.29 93.98,30.48 93.98,24.13 92.71,22.86 IC13.3 92.71,19.05 93.98,17.78 97.79,17.78 99.06,16.51 102.87,16.51 105.41,13.97 v110.49,13.97 | IBUS.9 132.08,12.7 130.81,13.97 v119.38,13.97
IBUS13  (via drill 0.6)
  Top 0.406: v109.22,15.24 v118.11,15.24 | v57.15,48.26 IC11.1
  Bottom 0.406: v57.15,48.26 59.69,48.26 68.58,39.37 90.17,39.37 99.06,30.48 99.06,24.13 97.79,22.86 IC13.5 97.79,19.05 99.06,17.78 102.87,17.78 105.41,15.24 v109.22,15.24 | IBUS.11 134.62,11.43 130.81,15.24 v118.11,15.24
IBUS14  (via drill 0.6)
  Top 0.406: IC11.10 72.39,59.69 71.12,58.42 v71.12,44.45 | v107.95,16.51 v119.38,16.51
  Bottom 0.406: v71.12,44.45 90.17,44.45 102.87,33.02 104.14,31.75 104.14,24.13 102.87,22.86 IC13.7 102.87,19.05 105.41,16.51 v107.95,16.51 | IBUS.13 137.16,10.16 130.81,16.51 v119.38,16.51
IBUS15  (via drill 0.6)
  Top 0.406: IC11.9 74.93,59.69 73.66,58.42 73.66,50.8 v72.39,49.53 | v113.03,22.86 115.57,22.86 118.11,20.32 v118.11,19.05
  Bottom 0.406: 107.95,22.86 109.22,24.13 109.22,31.75 102.87,38.1 90.17,49.53 v72.39,49.53 | IBUS.15 139.7,8.89 130.81,17.78 119.38,17.78 v118.11,19.05 | 107.95,22.86 IC13.9 | 107.95,22.86 v113.03,22.86
LOAD  (via drill 0.6)
  Top 0.406: IC11.11 69.85,59.69 68.58,58.42 68.58,48.26 67.31,46.99 67.31,41.91 68.58,40.64 IC10.11 68.58,26.67 67.31,25.4 64.77,25.4 v63.5,24.13 | v110.49,68.58 v118.11,68.58 | v137.16,66.04 139.7,63.5 IC5.11 | v125.73,68.58 v129.54,68.58 | v72.39,66.04 v88.9,66.04 | v39.37,33.02 38.1,31.75 IC4.10
  Bottom 0.406: 100.33,64.77 99.06,66.04 v88.9,66.04 | IC11.11 69.85,64.77 71.12,66.04 v72.39,66.04 | 100.33,64.77 IC8.11 | 100.33,64.77 101.6,66.04 107.95,66.04 v110.49,68.58 | v129.54,68.58 134.62,68.58 v137.16,66.04 | v118.11,68.58 v125.73,68.58 | v63.5,24.13 53.34,24.13 52.07,22.86 49.53,22.86 46.99,25.4 46.99,30.48 44.45,33.02 v39.37,33.02
N$1  (via drill 0.6)
  Top 0.406: IC6.2 90.17,76.2 92.71,78.74 v92.71,86.36 | v81.28,91.44 81.28,92.71 82.55,93.98 85.09,93.98 v86.36,95.25 | IC2.13 v59.69,85.09
  Bottom 0.406: v59.69,85.09 59.69,86.36 60.96,87.63 71.12,97.79 v81.28,97.79 83.82,97.79 v86.36,95.25 | v81.28,91.44 91.44,91.44 92.71,90.17 v92.71,86.36
N$2  (via drill 0.6)
  Top 0.406: v48.26,67.31 45.72,67.31 44.45,68.58 44.45,71.12 46.99,73.66 v49.53,73.66 | v73.66,67.31 77.47,67.31 v86.36,76.2
  Bottom 0.406: IC6.3 92.71,74.93 91.44,76.2 v86.36,76.2 | v73.66,67.31 66.04,67.31 64.77,66.04 58.42,66.04 57.15,67.31 v48.26,67.31 | v49.53,73.66 IC2.1
N$3  (via drill 0.6)
  Top 0.406: IC1.13 128.27,78.74 127,77.47 v114.3,77.47 | IC6.4 99.06,77.47 v106.68,77.47
  Bottom 0.406: v106.68,77.47 v114.3,77.47
N$4  (via drill 0.6)
  Top 0.406: IC6.5 100.33,76.2 v105.41,76.2 | IC1.1 125.73,74.93 124.46,76.2 v113.03,76.2
  Bottom 0.406: v105.41,76.2 v113.03,76.2
N$17  (via drill 0.6)
  Top 0.406: IC3.5 38.1,53.34 36.83,52.07 29.21,52.07 27.94,53.34 IC3.1 v21.59,54.61
  Bottom 0.406: IC3.5 IC3.6 | LOAD_WIDTH.1 v21.59,54.61
N$18
  Bottom 0.406: IC3.8 IC3.9 40.64,59.69 39.37,58.42 36.83,58.42 35.56,57.15 IC3.4
N$19  (via drill 0.6)
  Top 0.406: v20.32,57.15 30.48,57.15 33.02,59.69 IC3.12
  Bottom 0.406: IC3.10 IC3.11 IC3.12 | LOAD_WIDTH.3 v20.32,57.15
N$20
  Bottom 0.406: IC4.3 IC4.2 30.48,24.13 29.21,25.4 29.21,57.15 30.48,58.42 IC3.13
N$21
  Bottom 0.406: LOAD_WIDTH.5 11.43,58.42 11.43,25.4 16.51,20.32 IC4.1
N$22
  Bottom 0.406: LOAD_WIDTH.6 LOAD_WIDTH.4 LOAD_WIDTH.2 10.16,25.4 21.59,13.97 35.56,13.97 38.1,16.51 IC4.5
N$23
  Top 0.406: IC4.4 35.56,22.86 36.83,24.13 39.37,24.13 40.64,25.4 IC4.9
  Bottom 0.406: IC4.9 IC4.8
N$25  (via drill 0.6)
  Top 0.406: IC8.5 97.79,57.15 99.06,58.42 99.06,66.04 v102.87,69.85 | v120.65,83.82 v143.51,83.82 | v143.51,69.85 142.24,69.85 v139.7,67.31
  Bottom 0.406: v120.65,83.82 119.38,83.82 v118.11,82.55 118.11,73.66 114.3,69.85 v102.87,69.85 | v143.51,83.82 144.78,82.55 144.78,71.12 v143.51,69.85 | IC5.12 137.16,63.5 139.7,66.04 v139.7,67.31
N$26  (via drill 0.6, 0.61)
  Top 0.406: IC10.14 v60.96,39.37 60.96,40.64 60.96,58.42 62.23,59.69 IC11.14 v62.23,68.58 | v88.9,69.85 92.71,66.04 IC8.14 | v81.28,74.93 81.28,72.39 77.47,68.58 73.66,68.58 72.39,69.85 v72.39,71.12 | v121.92,55.88 124.46,58.42 v125.73,58.42 | v31.75,38.1 v35.56,38.1
  Bottom 0.406: IC8.14 92.71,59.69 93.98,58.42 119.38,58.42 v121.92,55.88 | v125.73,58.42 129.54,58.42 132.08,60.96 IC5.14 | v62.23,68.58 63.5,68.58 66.04,71.12 v72.39,71.12 | v81.28,74.93 86.36,69.85 v88.9,69.85 | v60.96,39.37 59.69,40.64 49.53,40.64 46.99,38.1 v35.56,38.1 | IC4.13 30.48,36.83 v31.75,38.1
N$29  (via drill 0.6)
  Top 0.406: v80.01,30.48 85.09,35.56 85.09,50.8 81.28,54.61 v81.28,57.15
  Bottom 0.406: IC10.5 66.04,22.86 67.31,24.13 74.93,24.13 80.01,29.21 v80.01,30.48 | v81.28,57.15 81.28,63.5 82.55,64.77 96.52,64.77 97.79,63.5 IC8.12
N$31
  Top 0.406: IC10.12 66.04,46.99 67.31,48.26 IC11.5
REG0  (via drill 0.6)
  Top 0.406: IC5.3 132.08,53.34 125.73,46.99 v125.73,39.37
  Bottom 0.406: IC12.17 134.62,31.75 130.81,35.56 127,35.56 125.73,36.83 v125.73,39.37 | IC5.3 132.08,57.15 133.35,58.42 133.35,67.31 128.27,67.31 127,68.58 127,71.12 128.27,72.39 IC1.2 128.27,77.47 127,78.74 127,82.55 124.46,85.09 CONSOLE.1
REG1  (via drill 0.6)
  Top 0.406: v118.11,39.37 123.19,39.37 124.46,40.64 124.46,46.99 129.54,52.07 IC5.2 129.54,58.42 130.81,59.69 IC1.3
  Bottom 0.406: IC12.2 129.54,22.86 130.81,24.13 130.81,30.48 129.54,31.75 127,31.75 119.38,39.37 v118.11,39.37 | IC1.3 130.81,77.47 129.54,78.74 129.54,82.55 125.73,86.36 125.73,92.71 CONSOLE.2
REG2  (via drill 0.6)
  Top 0.406: v135.89,48.26 135.89,49.53 139.7,53.34 IC5.6 | v151.13,31.75 140.97,31.75 139.7,30.48 IC12.15 | v129.54,71.12 129.54,77.47 130.81,78.74 IC1.12
  Bottom 0.406: v151.13,31.75 149.86,31.75 135.89,45.72 v135.89,48.26 | IC5.6 139.7,57.15 140.97,58.42 140.97,67.31 138.43,69.85 130.81,69.85 v129.54,71.12 | IC1.12 130.81,82.55 127,86.36 CONSOLE.3
REG3  (via drill 0.6)
  Top 0.406: v127,38.1 129.54,38.1 130.81,39.37 130.81,43.18 133.35,45.72 137.16,45.72 142.24,50.8 IC5.7 147.32,59.69 147.32,63.5 144.78,66.04 v142.24,66.04
  Bottom 0.406: IC12.4 134.62,22.86 135.89,24.13 135.89,31.75 129.54,38.1 v127,38.1 | v142.24,66.04 142.24,67.31 138.43,71.12 134.62,71.12 133.35,72.39 IC1.4 133.35,77.47 132.08,78.74 132.08,82.55 128.27,86.36 128.27,92.71 CONSOLE.4
REG4  (via drill 0.6)
  Top 0.406: v120.65,45.72 119.38,46.99 119.38,63.5 v121.92,66.04 | v132.08,66.04 132.08,77.47 133.35,78.74 IC1.11
  Bottom 0.406: IC12.13 144.78,30.48 129.54,45.72 v120.65,45.72 97.79,45.72 92.71,50.8 IC8.3 | v121.92,66.04 v132.08,66.04 | IC1.11 133.35,82.55 129.54,86.36 CONSOLE.5
REG5  (via drill 0.6)
  Top 0.406: v116.84,41.91 118.11,43.18 v118.11,63.5 | IC8.2 90.17,52.07 99.06,43.18 104.14,43.18 v105.41,41.91 | v134.62,64.77 134.62,67.31 135.89,68.58 IC1.5
  Bottom 0.406: IC12.6 139.7,22.86 140.97,24.13 140.97,30.48 129.54,41.91 v116.84,41.91 v105.41,41.91 | v118.11,63.5 119.38,64.77 v134.62,64.77 | IC1.5 135.89,77.47 134.62,78.74 134.62,82.55 130.81,86.36 130.81,92.71 CONSOLE.6
REG6  (via drill 0.6)
  Top 0.406: v133.35,52.07 133.35,67.31 134.62,68.58 134.62,77.47 135.89,78.74 IC1.10 | v95.25,50.8 97.79,50.8 100.33,53.34 IC8.6
  Bottom 0.406: 130.81,49.53 149.86,30.48 IC12.11 | 130.81,49.53 129.54,50.8 v95.25,50.8 | 130.81,49.53 130.81,50.8 132.08,52.07 v133.35,52.07 | IC1.10 135.89,82.55 132.08,86.36 CONSOLE.7
REG7  (via drill 0.6)
  Top 0.406: v128.27,46.99 130.81,46.99 135.89,52.07 135.89,67.31 137.16,68.58 137.16,77.47 138.43,78.74 IC1.9 | IC8.7 102.87,50.8 100.33,48.26 v97.79,48.26
  Bottom 0.406: IC12.8 144.78,22.86 146.05,24.13 146.05,30.48 129.54,46.99 v128.27,46.99 99.06,46.99 v97.79,48.26 | IC1.9 138.43,82.55 133.35,87.63 133.35,92.71 CONSOLE.8
REG8  (via drill 0.6)
  Top 0.406: CONSOLE.9 133.35,90.17 123.19,90.17 119.38,93.98 87.63,93.98 83.82,90.17 59.69,90.17 58.42,88.9 58.42,77.47 59.69,76.2 IC2.2 59.69,72.39 58.42,71.12 46.99,71.12 v45.72,69.85 | IC10.3 60.96,22.86 62.23,24.13 v62.23,31.75 | v54.61,31.75 v45.72,40.64
  Bottom 0.406: IC13.2 90.17,22.86 91.44,24.13 91.44,30.48 90.17,31.75 v62.23,31.75 v54.61,31.75 | v45.72,40.64 v45.72,69.85
REG9  (via drill 0.6)
  Top 0.406: CONSOLE.10 132.08,96.52 85.09,96.52 83.82,95.25 v78.74,95.25 | IC10.2 58.42,22.86 59.69,24.13 v59.69,36.83 | v46.99,68.58 48.26,69.85 59.69,69.85 62.23,72.39 IC2.3 62.23,77.47 60.96,78.74 v60.96,83.82 | v46.99,41.91 52.07,36.83 v54.61,36.83
  Bottom 0.406: IC13.4 95.25,22.86 96.52,24.13 96.52,30.48 90.17,36.83 v59.69,36.83 v54.61,36.83 | v46.99,41.91 v46.99,68.58 | v78.74,95.25 77.47,96.52 71.12,96.52 60.96,86.36 v60.96,83.82
REG10  (via drill 0.6, 0.61)
  Top 0.406: CONSOLE.11 134.62,88.9 v121.92,88.9 118.11,92.71 88.9,92.71 85.09,88.9 v67.31,88.9 60.96,88.9 v59.69,87.63 | IC10.6 68.58,22.86 69.85,24.13 69.85,41.91 v68.58,43.18 | IC2.4 64.77,66.04 63.5,64.77 v63.5,46.99 | v15.24,85.09 16.51,86.36 v57.15,86.36
  Bottom 0.406: IC13.6 100.33,22.86 101.6,24.13 101.6,30.48 90.17,41.91 69.85,41.91 v68.58,43.18 67.31,43.18 v63.5,46.99 | PC-PAGE.1 5.08,82.55 7.62,85.09 v15.24,85.09 | v57.15,86.36 58.42,86.36 v59.69,87.63 | IC2.4 64.77,77.47 66.04,78.74 66.04,87.63 v67.31,88.9
REG11  (via drill 0.6)
  Top 0.406: CONSOLE.12 133.35,97.79 83.82,97.79 82.55,96.52 77.47,96.52 v76.2,95.25 | IC10.7 71.12,22.86 72.39,24.13 v72.39,46.99 | v64.77,48.26 66.04,49.53 66.04,64.77 67.31,66.04 IC2.5
  Bottom 0.406: IC13.8 105.41,22.86 106.68,24.13 106.68,31.75 102.87,35.56 90.17,46.99 v72.39,46.99 66.04,46.99 v64.77,48.26 | IC2.5 67.31,77.47 68.58,78.74 68.58,87.63 v76.2,95.25
REG12  (via drill 0.6)
  Top 0.406: CONSOLE.13 135.89,87.63 120.65,87.63 116.84,91.44 90.17,91.44 86.36,87.63 64.77,87.63 62.23,85.09 IC2.12 | IC11.3 v62.23,35.56 | v54.61,64.77 58.42,68.58 v59.69,68.58 | v15.24,82.55 17.78,85.09 39.37,85.09 v46.99,77.47
  Bottom 0.406: IC13.17 95.25,30.48 90.17,35.56 v62.23,35.56 | IC11.3 62.23,57.15 60.96,58.42 59.69,58.42 58.42,59.69 58.42,63.5 57.15,64.77 v54.61,64.77 | 59.69,76.2 v59.69,68.58 | PC-PAGE.3 8.89,82.55 v15.24,82.55 | v46.99,77.47 58.42,77.47 59.69,76.2 | 59.69,76.2 62.23,78.74 IC2.12
REG13  (via drill 0.6)
  Top 0.406: v78.74,92.71 v72.39,92.71 v63.5,92.71 | PC-PAGE.4 8.89,80.01 8.89,83.82 13.97,88.9 v54.61,88.9 | v59.69,49.53 IC11.2 59.69,58.42 60.96,59.69 60.96,69.85 63.5,72.39 63.5,77.47 64.77,78.74 IC2.11
  Bottom 0.406: IC13.15 100.33,30.48 90.17,40.64 68.58,40.64 v59.69,49.53 | CONSOLE.14 137.16,96.52 120.65,96.52 116.84,92.71 v78.74,92.71 | v72.39,92.71 68.58,92.71 64.77,88.9 IC2.11 | v54.61,88.9 58.42,92.71 v63.5,92.71
REG14  (via drill 0.6)
  Top 0.406: CONSOLE.15 137.16,86.36 v118.11,86.36 | v68.58,44.45 68.58,46.99 69.85,48.26 IC11.6 | v68.58,64.77 v68.58,76.2 67.31,77.47 IC2.10 | v116.84,60.96 116.84,44.45 114.3,41.91 114.3,38.1 105.41,29.21 IC13.13 | PC-PAGE.5 10.16,83.82 13.97,87.63 55.88,87.63 59.69,91.44 v76.2,91.44 | v116.84,69.85 v116.84,74.93
  Bottom 0.406: IC13.13 105.41,31.75 102.87,34.29 90.17,45.72 69.85,45.72 v68.58,44.45 | IC11.6 69.85,57.15 68.58,58.42 v68.58,64.77 | v76.2,91.44 74.93,90.17 73.66,90.17 71.12,87.63 71.12,78.74 v68.58,76.2 | v116.84,60.96 v116.84,69.85 | v116.84,74.93 116.84,85.09 v118.11,86.36
REG15  (via drill 0.6)
  Top 0.406: v71.12,64.77 v71.12,69.85 69.85,71.12 IC2.9 | F_NEG.1 6.35,74.93 PC-PAGE.6 | v15.24,80.01 19.05,83.82 35.56,83.82 v39.37,80.01
  Bottom 0.406: IC13.11 110.49,31.75 102.87,39.37 90.17,50.8 73.66,50.8 72.39,52.07 IC11.7 72.39,57.15 71.12,58.42 v71.12,64.77 | CONSOLE.16 138.43,97.79 119.38,97.79 115.57,93.98 76.2,93.98 69.85,87.63 IC2.9 | PC-PAGE.6 11.43,78.74 12.7,80.01 v15.24,80.01 | v39.37,80.01 49.53,69.85 55.88,69.85 58.42,67.31 64.77,67.31 67.31,69.85 v71.12,69.85
VCC
  pour Top (isolate 0.508, no thermals): 20.32,8.89 19.05,7.62 19.05,5.08 20.32,3.81 22.86,3.81 24.13,5.08 24.13,7.62 22.86,8.89
  pour Top (isolate 0.61, rank 6, no thermals): 0,100.33 0,0 160.02,0 160.02,100.33

### Text on the board
Top: (c) 2011 AlexiosC
Bottom: (c) 2011 AlexiosC
tNames: http://www.bedroomlan.org/hardware/cft | A only | A only | A only | PC only | A only | 3 | 2 | 1 | (c) 2011 AlexiosC | CFT CPU PC/DR/A Register Rev A
tValues: +12V | +5V | GND